# Altium schematic sheet BLOCK DIAGRAM.SchDoc
size A3; Date: 12/09/2026; DrawnBy: Juan Alejandro Villodres Perdomo; Revision: 1.0; SheetNumber: 2; SheetTotal: 4; SheetDescription: A simplified block diagram made with hierachical blocks for system description.
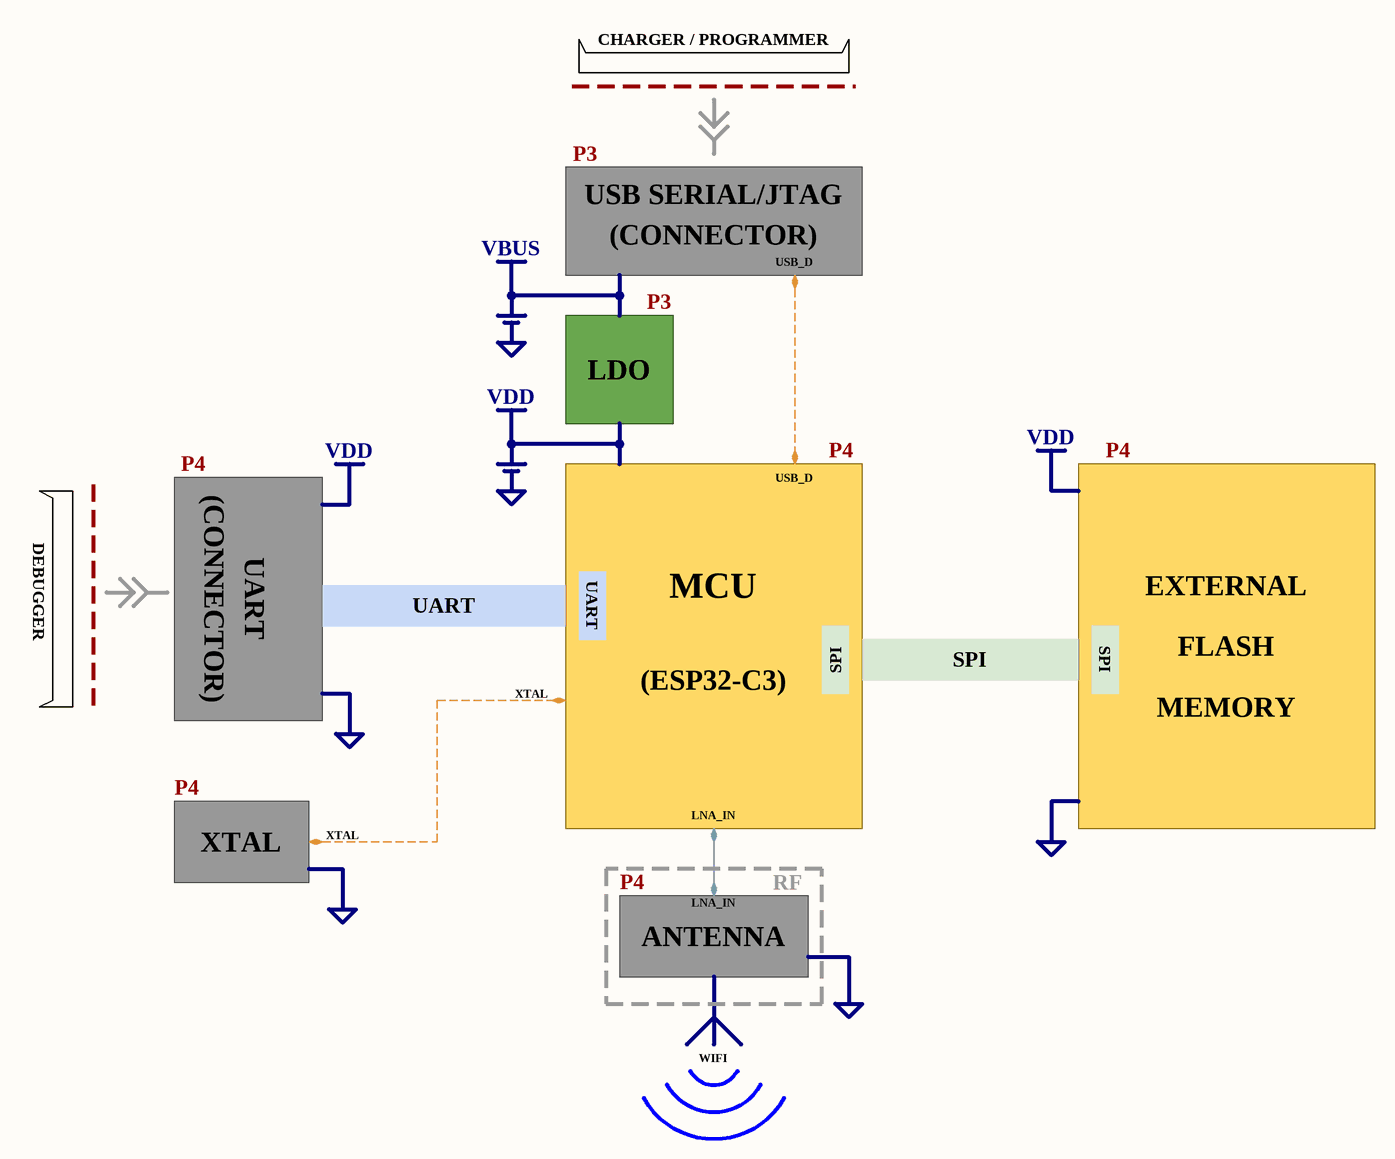
[diagram p0: BLOCK DIAGRAM.SchDoc]

## Notes on the sheet
- CHARGER / PROGRAMMER
- P3
- USB SERIAL/JTAG
- (CONNECTOR)
- VBUS
- USB_D
- LDO
- VDD
- P4
- DEBUGGER
- UART
- MCU
- EXTERNAL
- XTAL
- (ESP32-C3)
- SPI
- FLASH
- MEMORY
- LNA_IN
- RF
- ANTENNA
- WIFI
- Project Name:
- Sheet Description:
- CONNECTIONS
- PX
- BLOCKS
- BUSES
- Sheet Title:
- PWR
- SIG
- POWER - IC
- DIGITAL - IC
- ANALOG - IC
- DISCRETE
- Designer:
- DIFF. PAIR
- PX - PAGE NUMBER
- ISOLATED
- Date initialized:
- Last modified:
- Version:
- Size:
- A3
- Sheet:
- Of